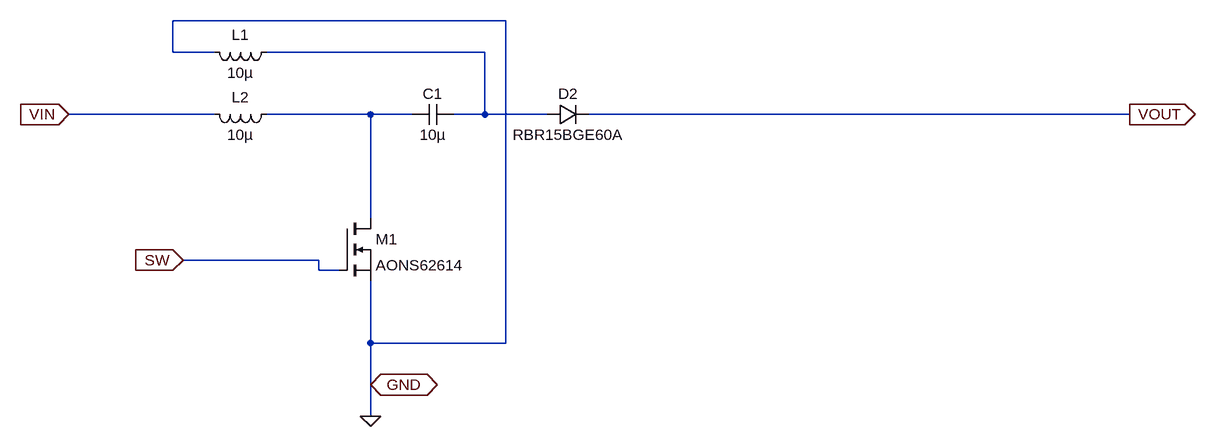
[diagram p0: schematic SEPIC_simulation.asc]
SEPIC_simulation.asc, the LTspice schematic file:
Version 4.1
SHEET 1 1516 680
WIRE 432 -64 -80 -64
WIRE -80 -16 -80 -64
WIRE -16 -16 -80 -16
WIRE 400 -16 64 -16
WIRE -16 80 -240 80
WIRE 224 80 64 80
WIRE 288 80 224 80
WIRE 400 80 400 -16
WIRE 400 80 352 80
WIRE 496 80 400 80
WIRE 1392 80 560 80
WIRE 224 240 224 80
WIRE 144 304 -64 304
WIRE 144 320 144 304
WIRE 176 320 144 320
WIRE 224 432 224 336
WIRE 432 432 432 -64
WIRE 432 432 224 432
WIRE 224 496 224 432
WIRE 224 544 224 496
FLAG 224 544 0
FLAG -64 304 SW
IOPIN -64 304 In
FLAG 224 496 GND
IOPIN 224 496 BiDir
FLAG 1392 80 VOUT
IOPIN 1392 80 Out
FLAG -240 80 VIN
IOPIN -240 80 In
SYMBOL nmos 176 240 R0
SYMATTR InstName M1
SYMATTR Value AONS62614
SYMBOL cap 352 64 R90
WINDOW 0 0 32 VBottom 2
WINDOW 3 32 32 VTop 2
SYMATTR InstName C1
SYMATTR Value 10µ
SYMATTR SpiceLine Rser=10m
SYMBOL diode 496 96 R270
WINDOW 0 32 32 VTop 2
WINDOW 3 0 32 VBottom 2
SYMATTR InstName D2
SYMATTR Value RBR15BGE60A
SYMBOL ind 80 64 R90
WINDOW 0 5 56 VBottom 2
WINDOW 3 32 56 VTop 2
SYMATTR InstName L2
SYMATTR Value 10µ
SYMATTR SpiceLine Ipk=9.4 Rser=0.013 Rpar=942 Cpar=0 mfg="Coilcraft" pn="MSS1210H-103"
SYMBOL ind 80 -32 R90
WINDOW 0 5 56 VBottom 2
WINDOW 3 32 56 VTop 2
SYMATTR InstName L1
SYMATTR Value 10µ
SYMATTR SpiceLine Ipk=9.4 Rser=0.013 Rpar=942 Cpar=0 mfg="Coilcraft" pn="MSS1210H-103"

The netlist it stands for:
* SEPIC_simulation.asc
M1 N002 SW 0 0 AONS62614
C1 N001 N002 10µ Rser=10m
D2 N001 VOUT RBR15BGE60A
L2 N002 VIN 10µ Ipk=9.4 Rser=0.013 Rpar=942 Cpar=0 mfg="Coilcraft" pn="MSS1210H-103"
L1 N001 0 10µ Ipk=9.4 Rser=0.013 Rpar=942 Cpar=0 mfg="Coilcraft" pn="MSS1210H-103"
.model D D
.lib standard.dio
.model NMOS NMOS
.model PMOS PMOS
.lib standard.mos
.backanno
.end